# EAGLE design V2 (EAGLE 6.3)
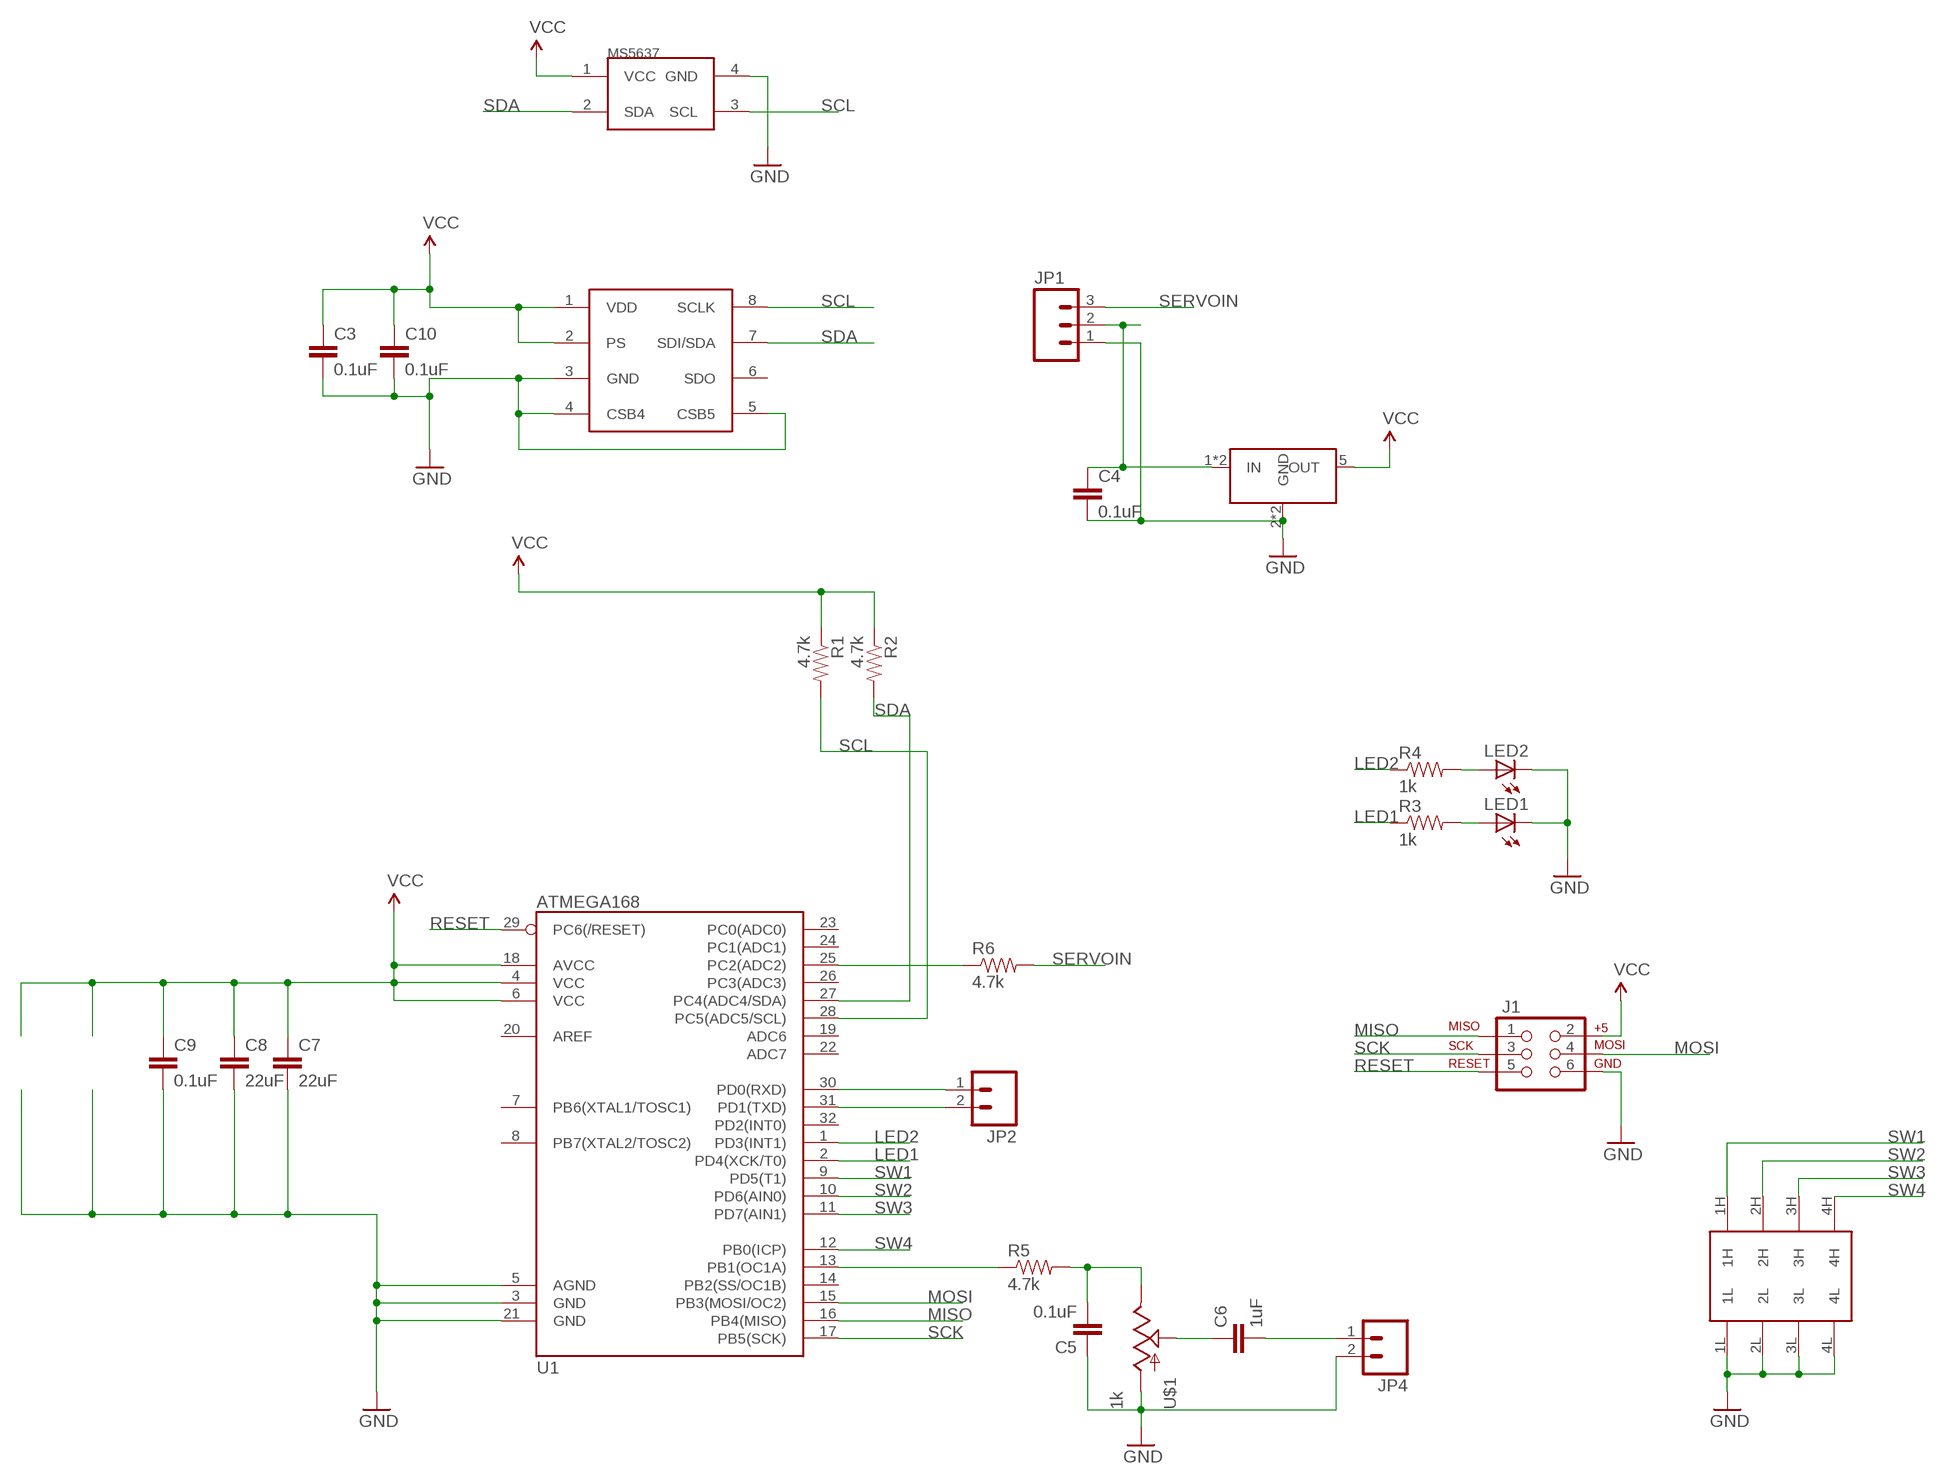
[diagram p0: schematic, sheet 1]

## Parts
C3  0.1uF  CAP0603-CAP  [0603-CAP]
C4  0.1uF  CAP0603-CAP  [0603-CAP]
C5  0.1uF  CAP0603-CAP  [0603-CAP]
C6  1uF  CAP0603-CAP  [0603-CAP]
C7  22uF  CAP0805  [0805]
C8  22uF  CAP0805  [0805]
C9  0.1uF  CAP0603-CAP  [0603-CAP]
C10  0.1uF  CAP0603-CAP  [0603-CAP]
J1  AVR_SPI_PRG_6NS  [2X3-NS]
JP1  M03PTH  [1X03]
JP2  M02PTH  [1X02]
JP4  M02PTH  [1X02]
LED1  LED0603  [LED-0603]
LED2  LED0603  [LED-0603]
R1  4.7k  RESISTOR0603-RES  [0603-RES]
R2  4.7k  RESISTOR0603-RES  [0603-RES]
R3  1k  RESISTOR0603-RES  [0603-RES]
R4  1k  RESISTOR0603-RES  [0603-RES]
R5  4.7k  RESISTOR0603-RES  [0603-RES]
R6  4.7k  RESISTOR0603-RES  [0603-RES]
U1  ATMEGA168  [TQFP32-08]
U$1  1k  POTBOURNS_3306KPW  [BOURNS_3306KPW]
U$2  MS5611  [MS5611]
U$3  LINEAR_REGSOT23-5_TOREX  [SOT23-5]
U$4  MS5637  [MS5637]
U$5  DIP_SWITCH  [DIPSWITCH4]

## Nets
GND: C3.2 C4.2 C5.1 C7.2 C8.2 C9.2 C10.2 J1.6 JP1.1 JP4.2 LED1.C LED2.C U1.3(GND) U1.5(AGND) U1.21(GND) U$1.3(A) U$2.3(GND) U$2.4(CSB4) U$2.5(CSB5) U$3.2(GND) U$3.3(GND) U$4.4(GND) U$5.1L U$5.2L U$5.3L U$5.4L
LED1: R3.1 U1.2(PD4(XCK/T0))
LED2: R4.1 U1.1(PD3(INT1))
MISO: J1.1 U1.16(PB4(MISO))
MOSI: J1.4 U1.15(PB3(MOSI/OC2))
N$1: R6.1 U1.25(PC2(ADC2))
N$6: C4.1 JP1.2 U$3.1(IN) U$3.4(IN)
N$8: JP2.1 U1.30(PD0(RXD))
N$9: LED2.A R4.2
N$10: LED1.A R3.2
N$11: JP2.2 U1.31(PD1(TXD))
N$12: R5.1 U1.13(PB1(OC1A))
N$13: C5.2 R5.2 U$1.1(E)
N$15: C6.1 U$1.2(S)
N$16: C6.2 JP4.1
RESET: J1.5 U1.29(PC6(/RESET))
SCK: J1.3 U1.17(PB5(SCK))
SCL: R1.2 U1.28(PC5(ADC5/SCL)) U$2.8(SCLK) U$4.3(SCL)
SDA: R2.2 U1.27(PC4(ADC4/SDA)) U$2.7(SDI/SDA) U$4.2(SDA)
SERVOIN: JP1.3 R6.2
SW1: U1.9(PD5(T1)) U$5.1H
SW2: U1.10(PD6(AIN0)) U$5.2H
SW3: U1.11(PD7(AIN1)) U$5.3H
SW4: U1.12(PB0(ICP)) U$5.4H
VCC: C3.1 C7.1 C8.1 C9.1 C10.1 J1.2 R1.1 R2.1 U1.4(VCC) U1.6(VCC) U1.18(AVCC) U$2.1(VDD) U$2.2(PS) U$3.5(OUT) U$4.1(VCC)
Unconnected: U1.7(PB6(XTAL1/TOSC1)) U1.8(PB7(XTAL2/TOSC2)) U1.14(PB2(SS/OC1B)) U1.19(ADC6) U1.20(AREF) U1.22(ADC7) U1.23(PC0(ADC0)) U1.24(PC1(ADC1)) U1.26(PC3(ADC3)) U1.32(PD2(INT0)) U$2.6(SDO)

## Library data of the parts
C3-C10 = SparkFun-Passives:CAP: Capacitor Standard 0603 ceramic capacitor, and 0.1" leaded capacitor.
J1 = SparkFun-Connectors:AVR_SPI_PRG_6: AVR ISP 6 Pin This is the reduced ISP connector for AVR programming. Common on Arduino. This footprint will take up less PCB space and can be used with a 10-pin to 6-pin adapter such as SKU: BOB-08508
JP1 = SparkFun-Connectors:M03: Header 3 Standard 3-pin 0.1" header. Use with straight break away headers (SKU : PRT-00116), right angle break away headers (PRT-00553), swiss pins (PRT-00743), machine pins (PRT-00117), and female headers (PRT-00115). Molex polarized connector foot print use with SKU : PRT-08232 with associated crimp pins and housings.
JP2 JP4 = SparkFun-Connectors:M02: Header 2 Standard 2-pin 0.1" header. Use with straight break away headers (SKU : PRT-00116), right angle break away headers (PRT-00553), swiss pins (PRT-00743), machine pins (PRT-00117), and female headers (PRT-00115). Molex polarized connector foot print use with SKU : PRT-08233 with associated crimp pins and housings.
LED1 LED2 = SparkFun-LED:LED: LEDs Standard schematic elements and footprints for 5mm, 3mm, 1206, and 0603 sized LEDs. 5mm - Spark Fun Electronics SKU : COM-00529 (and others)
R1-R6 = SparkFun-Passives:RESISTOR: Resistor Basic schematic elements and footprints for 0603, 1206, and PTH resistors.
U1 = SparkFun-DigitalIC:ATMEGA168: Atmel 32-pin 8-bit micro, 16k flash.
U$1 = Custom:POT
U$2 = Custom:MS5611
U$3 = Custom:LINEAR_REG
U$4 = Custom:MS5637
U$5 = Custom:DIP_SWITCH

## Board
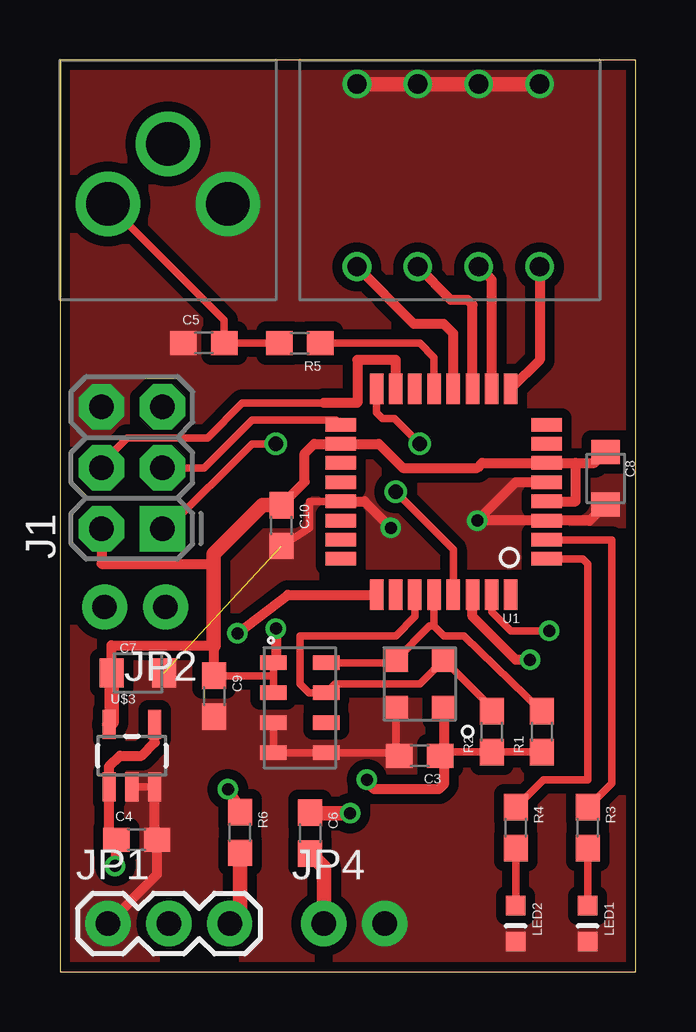
[diagram p1: board, top side]
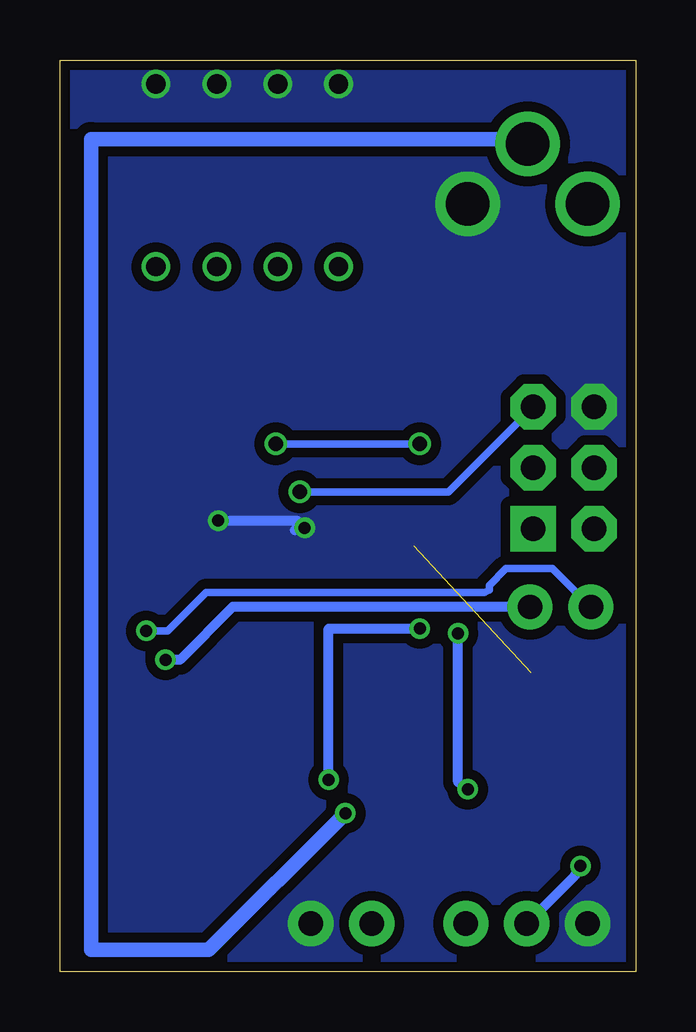
[diagram p2: board, bottom side, seen from below]

Size 24 x 38 mm. Coordinates in mm from the lower left corner, seen from the top.
Outline: 0,0 24,0 24,38 0,38 0,0
Copper layers (1*16): Top 0.0356mm / dielectric 1.5011mm / Bottom 0.0356mm
Design rules "default": minimum track width 6mil, minimum drill 13mil, track to track 6mil, track to pad 6mil, pad to pad 6mil, via to via 6mil, smd to smd 6mil, copper to edge 15mil, drill to drill 6mil, minimum pad ring 7mil, minimum via ring 7mil, stop-mask expansion 4mil, vias tented up to drill 22mil, thermal gap 10mil

### Footprints (pad centres in the part's own frame; a part is rotated, then mirrored left to right if it is on the bottom)
0603-CAP = smd 1.1 x 1: 1 -0.85,0; 2 0.85,0
0805 = smd 1 x 1.2: 1 -1.1,0; 2 1.1,0
2X3-NS = drill 1.016 pad 1.88 square: 1 -2.54,-1.27 | drill 1.016 pad 1.88 octagon: 2 -2.54,1.27; 3 0,-1.27; 4 0,1.27; 5 2.54,-1.27; 6 2.54,1.27
1X03 = drill 1.016 pad 1.88: 1 0,0; 2 2.54,0; 3 5.08,0
1X02 = drill 1.016 pad 1.88: 1 0,0; 2 2.54,0
LED-0603 = smd 0.8 x 0.8: A 0,-0.75; C 0,0.75
0603-RES = smd 1.1 x 1: 1 -0.85,0; 2 0.85,0
TQFP32-08 = smd 1.27 x 0.559: 1 -4.293,2.8; 2 -4.293,2; 3 -4.293,1.2; 4 -4.293,0.4; 5 -4.293,-0.4; 6 -4.293,-1.2; 7 -4.293,-2; 8 -4.293,-2.8; 17 4.293,-2.8; 18 4.293,-2; 19 4.293,-1.2; 20 4.293,-0.4; 21 4.293,0.4; 22 4.293,1.2; 23 4.293,2; 24 4.293,2.8 | smd 0.559 x 1.27: 9 -2.8,-4.293; 10 -2,-4.293; 11 -1.2,-4.293; 12 -0.4,-4.293; 13 0.4,-4.293; 14 1.2,-4.293; 15 2,-4.293; 16 2.8,-4.293; 25 2.8,4.293; 26 2,4.293; 27 1.2,4.293; 28 0.4,4.293; 29 -0.4,4.293; 30 -1.2,4.293; 31 -2,4.293; 32 -2.8,4.293
BOURNS_3306KPW = drill 1.8: 1 0,0; 2 2.5,2.5; 3 5,0
MS5611 = smd 1.1 x 0.6: 1 -1.1,1.875; 2 -1.1,0.625; 3 -1.1,-0.625; 4 -1.1,-1.875; 5 1.1,-1.875; 6 1.1,-0.625; 7 1.1,0.625; 8 1.1,1.875
SOT23-5 = smd 0.55 x 1.2: 1 -0.95,-1.3; 2 0,-1.3; 3 0.95,-1.3; 4 0.95,1.3; 5 -0.95,1.3
MS5637 = smd 1 x 1: 1 -1,1; 2 -1,-1; 3 1,-1; 4 1,1
DIPSWITCH4 = drill 0.8: 1H 0,7.62; 1L 0,0; 2H 2.54,7.62; 2L 2.54,0; 3H 5.08,7.62; 3L 5.08,0; 4H 7.62,7.62; 4L 7.62,0

### Placement (x,y rotation side)
C3  15,9 180 top
C4  3.2,5.5 0 top
C5  6,26.2 0 top
C6  10.43,5.77 270 top
C7  3.25,12.45 0 top
C8  22.75,20.56 270 top
C9  6.43,11.48 270 top
C10  9.23,18.59 270 top
J1  3,21 90 top
JP1  2,2 0 top
JP2  4.4,15.2 180 top
JP4  11,2 0 top
LED1  22,2 180 top
LED2  19,2 180 top
R1  20.1,10 90 top
R2  18,10 90 top
R3  22,6 270 top
R4  19,6 270 top
R5  10,26.2 180 top
R6  7.5,5.8 270 top
U1  16,20 180 top
U$1  2,32 0 top
U$2  10,11 0 top
U$3  3,9 0 top
U$4  15,12 180 top
U$5  20,37 180 top

### Tracks (layer width: path | path; a pad name or v marks a point on that pad's centre or on a via)
GND  (via drill 0.5)  (1 unrouted)
  Top 0.305: U$4.4 14,9.15 C3.2 14.03,9.12 U$2.5 U$2.4 U$2.3 | U$3.2 U$3.3 | U1.21 10.4,19.6 10.4,18.5 C10.2
  Top 0.406: JP1.1 4.05,4.05 C4.2 3.95,5.6 U$3.3 | C8.2 22.09,18.8 U1.3 v17.4,18.8 19,20.4 U1.5 | U1.21 12.7,19.6 v13.8,18.5
  Top 0.61: U$5.1L U$5.2L U$5.3L U$5.4L
  Bottom 0.406: 14.2,18.4 14.1,18.5 v13.8,18.5 14.1,18.8 v17.4,18.8
  pour Top (isolate 0.406, no thermals): 0,38 0,0 24,0 24,38
  pour Bottom (isolate 0.406, no thermals): 0,38 0,0 24,0 24,38
LED1
  Top 0.305: R3.1 23,7.85 23,18 U1.2
LED2
  Top 0.305: R4.1 20.15,8 22,8 22,17 21.8,17.2 U1.1
MISO  (via drill 0.6)
  Top 0.305: J1.1 4.46,18.46 8,22 v9,22 | v15,22 13.95,23.05 13.45,23.05 13.2,23.3 U1.16
  Bottom 0.305: v9,22 v15,22
MOSI
  Top 0.305: 11,23.7 7.6,23.7 6.15,22.25 2.8,22.25 1.73,21.18 J1.4
  Top 0.406: U1.15 14,25.5 12.4,25.5 12.4,23.7 11,23.7
N$1  (via drill 0.5)
  Top 0.406: R6.1 7.6,6.75 v7,7.6 | v7.4,14.1 9.51,15.71 U1.25
  Bottom 0.406: v7,7.6 7.4,7.9 v7.4,14.1
N$6  (via drill 0.5)
  Top 0.406: U$3.4 3.95,9.55 3.4,9 2.5,9 2.05,8.55 U$3.1 2.05,5.8 C4.1 2.35,4.35 v2.3,4.4
  Bottom 0.406: JP1.2 2.54,4 v2.3,4.4
N$8  (via drill 0.5)
  Top 0.406: v19.6,13 19,13 17.2,14.8 U1.30
  Bottom 0.406: JP2.1 16.8,15.2 19,13 v19.6,13
N$9
  Top 0.305: LED2.A R4.2
N$10
  Top 0.305: LED1.A R3.2
N$11  (via drill 0.5)
  Top 0.305: v20.4,14.2 18.8,14.2 18,15 U1.31
  Bottom 0.305: JP2.2 3.46,16.8 5.4,16.8 6.1,16.1 6.1,15.9 6.29,15.81 17.9,15.81 19.51,14.2 v20.4,14.2
N$12
  Top 0.305: U1.13 15.6,25.6 15,26.2 R5.1
N$13
  Top 0.305: R5.2 C5.2 6.85,27.15 U$1.1
N$15  (via drill 0.5)
  Top 0.61: C6.1 10.45,6.6 v12.1,6.6
  Bottom 0.61: v12.1,6.6 17.8,0.9 22.7,0.9 22.7,34.7 4.5,34.7 U$1.2
N$16
  Top 0.61: C6.2 11,4.35 JP4.1
RESET  (via drill 0.6)
  Top 0.305: v14,20 16.4,17.6 U1.29
  Bottom 0.305: J1.5 7.81,20 v14,20
SCK
  Top 0.305: J1.3 6,21 8,23 11.51,23 U1.17
SCL
  Top 0.305: U$2.8 13.88,12.88 U$4.3 15.4,14.4 15.6,14.4 | R1.2 16.85,14 16,14 15.6,14.4 | 15.6,14.4 U1.28
SDA
  Top 0.305: U1.27 14.8,14.8 14,14 10,14 10,12 10.38,11.62 U$2.7 11.47,12 15,12 U$4.2 18,11 R2.2
SERVOIN
  Top 0.61: JP1.3 7.5,2.42 R6.2
SW1
  Top 0.406: U$5.1H 20,25.49 U1.9
SW2
  Top 0.406: U1.10 18,28.84 U$5.2H
SW3
  Top 0.406: U1.11 17.2,27.8 17,28 16.3,28 U$5.3H
SW4
  Top 0.406: U1.12 16.4,26.6 16,27 14.76,27 U$5.4H
VCC  (via drill 0.5)
  Top 0.305: C3.1 16,9.15 | 16,9.15 R2.1 R1.1 | 16,9.15 U$4.1 | U$2.2 U$2.1 8.9,12.33 C9.1
  Top 0.406: C7.1 2.15,13.6 6.4,13.6 6.4,12.33 C9.1 | 21.5,21.2 U1.6 17.6,21.2 17.4,21 14.3,21 13.3,22 U1.18 10.6,22 10.2,21.6 10.2,20.41 C10.1 | 21.5,21.2 22.29,21.2 C8.1 | U1.4 21.5,19.6 21.5,21.2 | J1.2 1.73,17 6.4,17 | U$4.1 16,7.8 15.8,7.6 13.1,7.6 12.8,7.9 v12.8,8 | v9,14.3 9,12.97 arc-90 U$2.1
  Top 0.61: U$3.5 2.15,10.4 C7.1 | 6.4,13.6 6.4,17 6.4,17.4 8.44,19.44 C10.1
  Bottom 0.406: v12.8,8 12.8,14.3 v9,14.3